# EAGLE schematic Versie 3 (EAGLE 7.3.0)
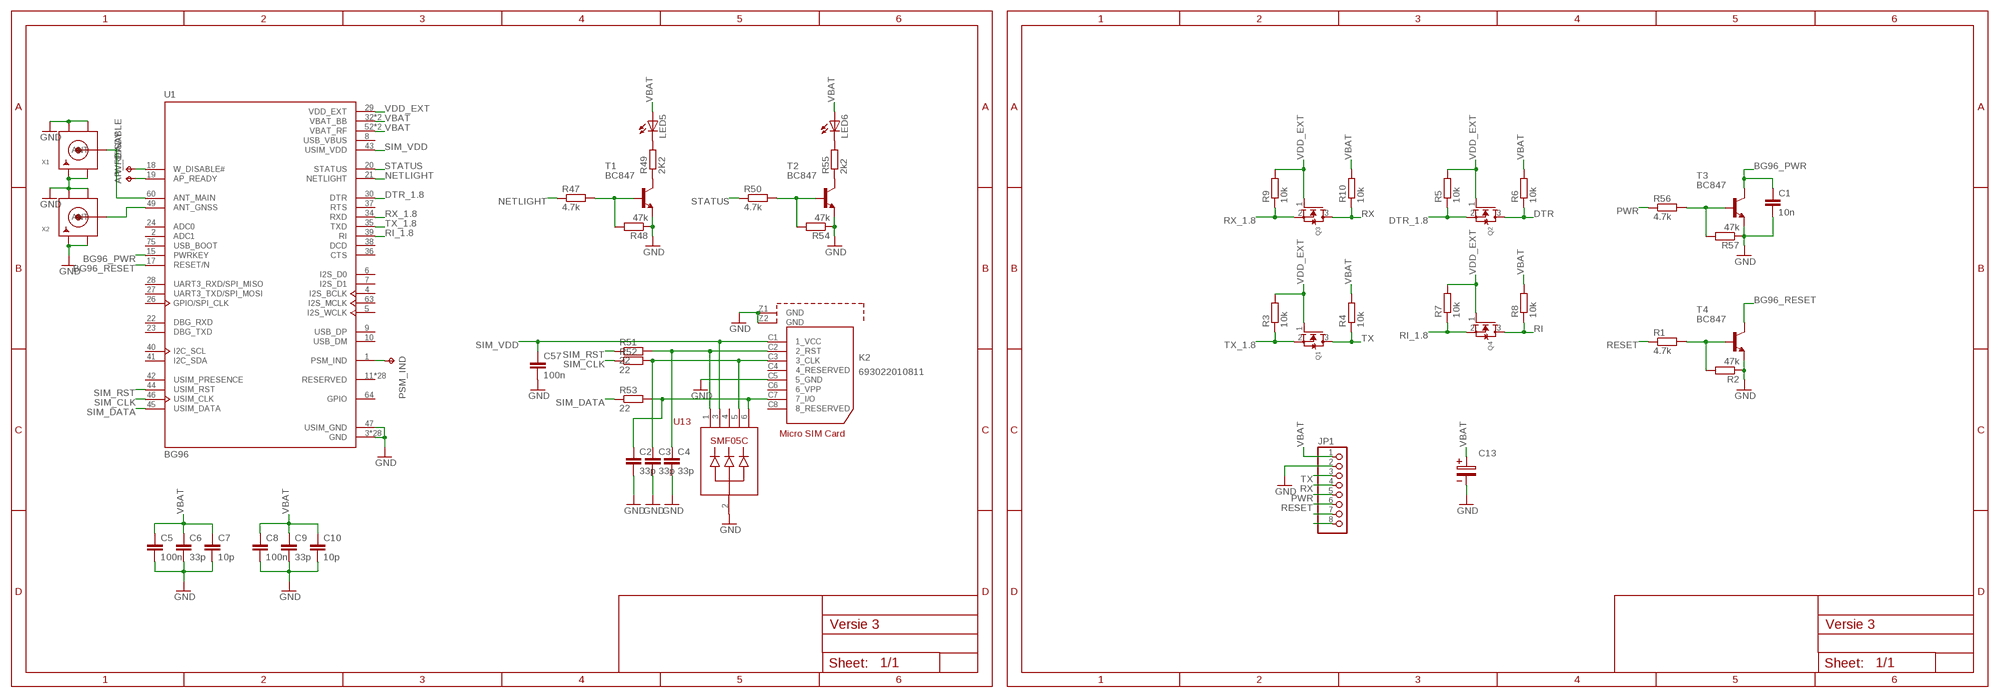
[diagram p0: schematic, sheet 1]

## Parts
AP_READY  TPTP10R  [TP10R]
C1  10n  C-EUC0603  [C0603]
C2  33p  C-EUC0603  [C0603]
C3  33p  C-EUC0603  [C0603]
C4  33p  C-EUC0603  [C0603]
C5  100n  C-EUC0603  [C0603]
C6  33p  C-EUC0603  [C0603]
C7  10p  C-EUC0603  [C0603]
C8  100n  C-EUC0603  [C0603]
C9  33p  C-EUC0603  [C0603]
C10  10p  C-EUC0603  [C0603]
C13  WCAP-ASLI_6,3X7,7_865080545012  [3.5X1.6X2.1(BXCXA)]
C57  100n  C-EUC0603  [C0603]
JP1  PINHD-1X8  [1X08]
K2  693022010811  [693022010811]
LED5  LEDCHIPLED_0805  [CHIPLED_0805]
LED6  LEDCHIPLED_0805  [CHIPLED_0805]
PSM_IND  TPTP10R  [TP10R]
Q1  MOSFET-NREFLOW  [SOT23]
Q2  MOSFET-NREFLOW  [SOT23]
Q3  MOSFET-NREFLOW  [SOT23]
Q4  MOSFET-NREFLOW  [SOT23]
R1  4.7k  R-EU_R0603  [R0603]
R2  47k  R-EU_R0603  [R0603]
R3  10k  R-EU_R0603  [R0603]
R4  10k  R-EU_R0603  [R0603]
R5  10k  R-EU_R0603  [R0603]
R6  10k  R-EU_R0603  [R0603]
R7  10k  R-EU_R0603  [R0603]
R8  10k  R-EU_R0603  [R0603]
R9  10k  R-EU_R0603  [R0603]
R10  10k  R-EU_R0603  [R0603]
R47  4.7k  R-EU_R0603  [R0603]
R48  47k  R-EU_R0603  [R0603]
R49  2K2  R-EU_R0603  [R0603]
R50  4.7k  R-EU_R0603  [R0603]
R51  22  R-EU_R0603  [R0603]
R52  22  R-EU_R0603  [R0603]
R53  22  R-EU_R0603  [R0603]
R54  47k  R-EU_R0603  [R0603]
R55  2k2  R-EU_R0603  [R0603]
R56  4.7k  R-EU_R0603  [R0603]
R57  47k  R-EU_R0603  [R0603]
T1  BC847  [SOT23]
T2  BC847  [SOT23]
T3  BC847  [SOT23]
T4  BC847  [SOT23]
U1  BG96  [LTE_MODULE_BG96]
U13  SMF05C  [SC-70-6]
W_DISABLE  TPTP10R  [TP10R]
X1  SMACONNECTOR_EDGE_UFL  [SMA_EDGELAUNCH_UFL]
X2  SMACONNECTOR_EDGE_UFL  [SMA_EDGELAUNCH_UFL]

## Nets
BG96_PWR: C1.1 T3.3(C) U1.15(PWRKEY)
BG96_RESET: T4.3(C) U1.17(RESET/N)
DTR: JP1.7 Q2.3(D) R6.1
DTR_1.8: Q2.2(S) R5.1 U1.30(DTR)
GND: C1.2 C2.2 C3.2 C4.2 C5.2 C6.2 C7.2 C8.2 C9.2 C10.2 C13.2 C57.2 JP1.2 K2.C5(5_GND) K2.Z1(GND) K2.Z2(GND) R2.1 R48.1 R54.1 R57.1 T1.2(E) T2.2(E) T3.2(E) T4.2(E) U1.3(GND) U1.31(GND) U1.47(USIM_GND) U1.48(GND) U1.50(GND) U1.54(GND) U1.55(GND) U1.58(GND) U1.59(GND) U1.61(GND) U1.62(GND) U1.67(GND) U1.68(GND) U1.69(GND) U1.70(GND) U1.71(GND) U1.72(GND) U1.73(GND) U1.74(GND) U1.79(GND) U1.80(GND) U1.81(GND) U1.82(GND) U1.89(GND) U1.90(GND) U1.91(GND) U1.100(GND) U1.101(GND) U1.102(GND) U13.2 X1.GND@1(GND1) X1.GND@2(GND2) X1.GND@3(GND3) X1.GND@4(GND4) X2.GND@1(GND1) X2.GND@2(GND2) X2.GND@3(GND3) X2.GND@4(GND4)
N$1: U1.60(ANT_MAIN) X1.P(ANT)
N$2: U1.49(ANT_GNSS) X2.P(ANT)
N$3: R1.2 R2.2 T4.1(B)
N$4: AP_READY.TP U1.19(AP_READY)
N$5: U1.18(W_DISABLE#) W_DISABLE.TP
N$29: R56.2 R57.2 T3.1(B)
N$30: C4.1 K2.C2(2_RST) R51.2 U13.1
N$31: C3.1 K2.C3(3_CLK) R52.2 U13.5
N$32: C2.1 K2.C7(7_I/O) R53.2 U13.6
N$33: R47.2 R48.2 T1.1(B)
N$34: R49.1 T1.3(C)
N$35: LED5.C R49.2
N$36: R50.2 R54.2 T2.1(B)
N$37: R55.1 T2.3(C)
N$38: LED6.C R55.2
NETLIGHT: R47.1 U1.21(NETLIGHT)
PSM_IND: PSM_IND.TP U1.1(PSM_IND)
PWR: JP1.5 R56.1
RESET: JP1.6 R1.1
RI: JP1.8 Q4.3(D) R8.1
RI_1.8: Q4.2(S) R7.1 U1.39(RI)
RX: JP1.4 Q3.3(D) R10.1
RX_1.8: Q3.2(S) R9.1 U1.34(RXD)
SIM_CLK: R52.1 U1.46(USIM_CLK)
SIM_DATA: R53.1 U1.45(USIM_DATA)
SIM_RST: R51.1 U1.44(USIM_RST)
SIM_VDD: C57.1 K2.C1(1_VCC) U1.43(USIM_VDD) U13.3
STATUS: R50.1 U1.20(STATUS)
TX: JP1.3 Q1.3(D) R4.1
TX_1.8: Q1.2(S) R3.1 U1.35(TXD)
VBAT: C5.1 C6.1 C7.1 C8.1 C9.1 C10.1 C13.1 JP1.1 LED5.A LED6.A R4.2 R6.2 R8.2 R10.2 U1.32(VBAT_BB) U1.33(VBAT_BB) U1.52(VBAT_RF) U1.53(VBAT_RF)
VDD_EXT: Q1.1(G) Q2.1(G) Q3.1(G) Q4.1(G) R3.2 R5.2 R7.2 R9.2 U1.29(VDD_EXT)
Unconnected: K2.C4(4_RESERVED) K2.C6(6_VPP) K2.C8(8_RESERVED) U1.2(ADC1) U1.4(I2S_BCLK) U1.5(I2S_WCLK) U1.6(I2S_D0) U1.7(I2S_D1) U1.9(USB_DP) U1.10(USB_DM) U1.11(RESERVED) U1.12(RESERVED) U1.13(RESERVED) U1.14(RESERVED) U1.16(RESERVED) U1.22(DBG_RXD) U1.23(DBG_TXD) U1.24(ADC0) U1.25(RESERVED) U1.26(GPIO/SPI_CLK) U1.27(UART3_TXD/SPI_MOSI) U1.28(UART3_RXD/SPI_MISO) U1.36(CTS) U1.37(RTS) U1.38(DCD) U1.40(I2C_SCL) U1.41(I2C_SDA) U1.42(USIM_PRESENCE) U1.51(RESERVED) U1.56(RESERVED) U1.57(RESERVED) U1.63(I2S_MCLK) U1.64(GPIO) U1.65(RESERVED) U1.66(RESERVED) U1.75(USB_BOOT) U1.76(RESERVED) U1.77(RESERVED) U1.78(RESERVED) U1.83(RESERVED) U1.84(RESERVED) U1.85(RESERVED) U1.86(RESERVED) U1.87(RESERVED) U1.88(RESERVED) U1.92(RESERVED) U1.93(RESERVED) U1.94(RESERVED) U1.95(RESERVED) U1.96(RESERVED) U1.97(RESERVED) U1.98(RESERVED) U1.99(RESERVED) U13.4

## Power pins joined to a net without a drawn wire
USB_VBUS: U1.8(USB_VBUS)

## Library data of the parts
AP_READY PSM_IND W_DISABLE = testpad:TP: Test pad
C1-C10 C57 = rcl:C-EU: CAPACITOR, European symbol
C13 = Kondensatoren (rev17a):WCAP-ASLI: WCAP-ASLI Aluminum Electrolytic Capacitors Characteristics Aluminum Electrolytic Capacitor Recommended soldering: Reflow Operating temperature: -55 °C to +105 °C Low impedance product series Load life:2000 h @ +105 °C Package name and Variant abbreviation: Package: Package: B X C X A = length of the solder pad X width of the solder pad X pitch of the solder pad. <http://katalog.we-online.de/media/images/eisos/WCAP-ASLI_pf2.jpg> Details see: http://katalog.we-online.de/en/pbs/WCAP-ASLI Updated by: Yingchun,Shan Updated: 2017-03-16 2017 (C) Wurth Elektronik; WE-NUMBER: 865080545012/100uF
JP1 = pinhead:PINHD-1X8: PIN HEADER
K2 = Wurth_Elektronik_Electromechanic_Input-Output_Connectors_rev15c:693022010811: WR-CRD_Micro SIM_Hinge_w Card Stop_SMT Micro SIM Hinge Type SMT - with Card Stop - 1.95mm Height - T&R with Mylar for Pick & Place Con_I-O_COM_CRD_SIM_Micro_693022010811_693022010811 <http://katalog.we-online.de/media/images/eican/Con_I-O_COM_CRD_SIM_Micro_693022010811_pf2.jpg> Details see: http://katalog.we-online.de/en/em/693_022_010_811/693_022_010_811?m Created 2014-12-22, aslant tao 2014 (C) Würth Elektronik
LED5 LED6 = adafruit:LED: LED OSRAM: - CHIPLED LG R971, LG N971, LY N971, LG Q971, LY Q971, LO R971, LY R971 LH N974, LH R974 LS Q976, LO Q976, LY Q976 LO Q996 - Hyper CHIPLED LW Q18S LB Q993, LB Q99A, LB R99A - SideLED LS A670, LO A670, LY A670, LG A670, LP A670 LB A673, LV A673, LT A673, LW A673 LH A674 LY A675 LS A676, LA A676, LO A676, LY A676, LW A676 LS A679, LY A679, LG A679 - Hyper Micro SIDELED® LS Y876, LA Y876, LO Y876, LY Y876 LT Y87S - SmartLED LW L88C, LW L88S LB L89C, LB L89S, LG L890 LS L89K, LO L89K, LY L89K LS L896, LA L896, LO L896, LY L896 - TOPLED LS T670, LO T670, LY T670, LG T670, LP T670 LSG T670, LSP T670, LSY T670, LOP T670, LYG T670 LG T671, LOG T671, LSG T671 LB T673, LV T673, LT T673, LW T673 LH T674 LS T676, LA T676, LO T676, LY T676, LB T676, LH T676, LSB T676, LW T676 LB T67C, LV T67C, LT T67C, LS T67K, LO T67K, LY T67K, LW E67C LS E67B, LA E67B, LO E67B, LY E67B, LB E67C, LV E67C, LT E67C LW T67C LS T679, LY T679, LG T679 LS T770, LO T770, LY T770, LG T770, LP T770 LB T773, LV T773, LT T773, LW T773 LH T774 LS E675, LA E675, LY E675, LS T675 LS T776, LA T776, LO T776, LY T776, LB T776 LHGB T686 LT T68C, LB T68C - Hyper Mini TOPLED® LB M676 - Mini TOPLED Santana® LG M470 LS M47K, LO M47K, LY M47K Source: http://www.osram.convergy.de/
Q1-Q4 = adafruit:MOSFET-N: N-Channel Mosfet 2N7002E - 60V 260mA SOT23 [Digikey: 2N7002ET1GOSTR-ND] - REEL BSH103 - 30V 850mA SOT23 [Digikey: 568-5013-1-ND]
R1-R10 R47-R57 = rcl:R-EU_: RESISTOR, European symbol
T1-T4 = transistor:BC847: NPN TRANSISTOR
U1 = BG96:BG96: Lte Cat.M1 Module For Global Sku; AVAILABILITY: Unavailable; DESCRIPTION: Lte Cat.M1 Module For Global Sku; MF: Quectel; MP: BG96; PACKAGE: None; PRICE: None
U13 = Design 13:SMF05C
X1 X2 = adafruit:SMACONNECTOR: SMA Connector 90° DIP SMA Connector, 50 Ohm (4UConnector: 07259)